# EAGLE schematic led_cube (EAGLE 6.2)
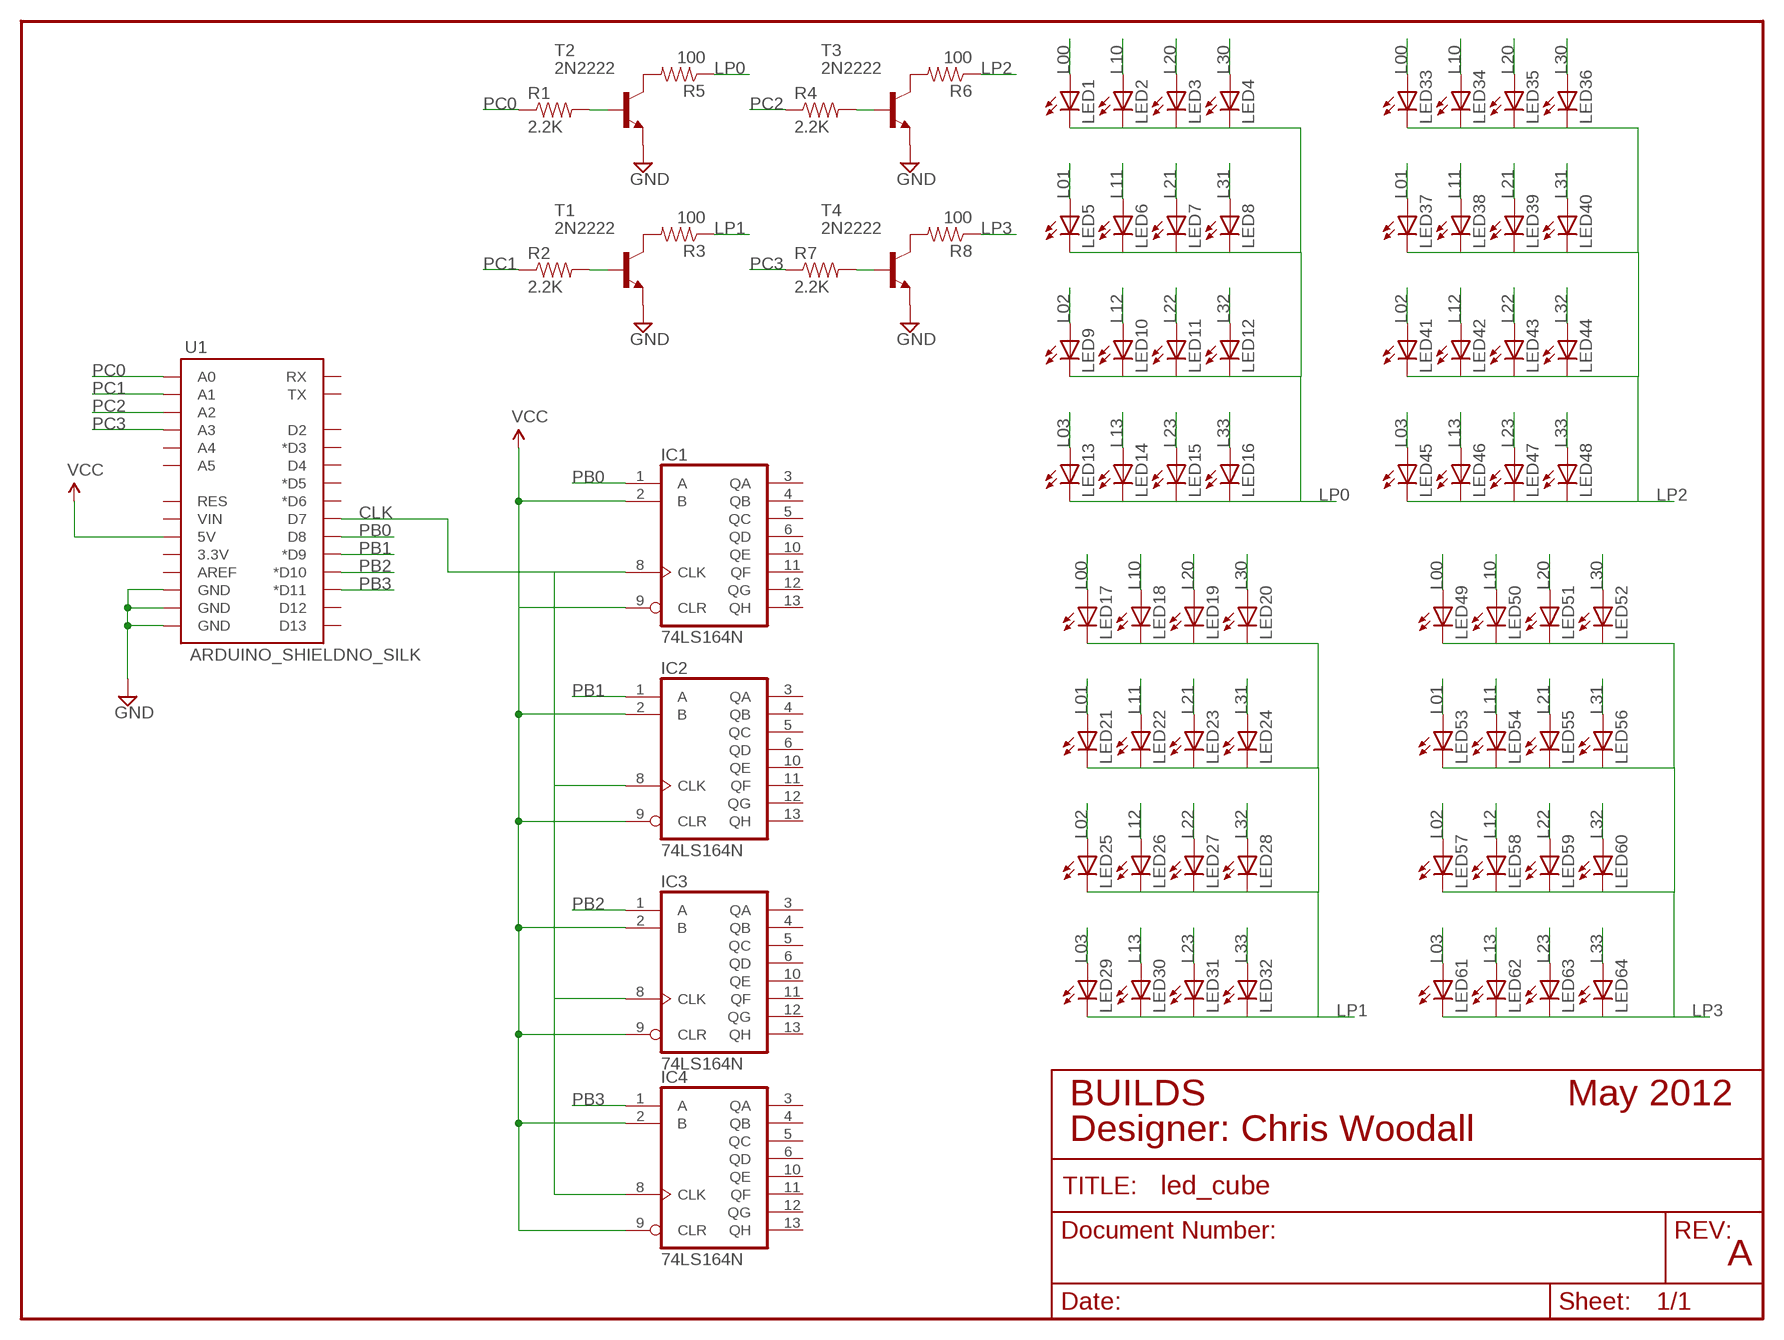
[diagram p0: schematic, sheet 1]

## Parts
IC1  74LS164N  [DIL14]
IC2  74LS164N  [DIL14]
IC3  74LS164N  [DIL14]
IC4  74LS164N  [DIL14]
LED1  LED  [SMARTLED-TTW]
LED2  LED  [SMARTLED-TTW]
LED3  LED  [SMARTLED-TTW]
LED4  LED  [SMARTLED-TTW]
LED5  LED  [SMARTLED-TTW]
LED6  LED  [SMARTLED-TTW]
LED7  LED  [SMARTLED-TTW]
LED8  LED  [SMARTLED-TTW]
LED9  LED  [SMARTLED-TTW]
LED10  LED  [SMARTLED-TTW]
LED11  LED  [SMARTLED-TTW]
LED12  LED  [SMARTLED-TTW]
LED13  LED  [SMARTLED-TTW]
LED14  LED  [SMARTLED-TTW]
LED15  LED  [SMARTLED-TTW]
LED16  LED  [SMARTLED-TTW]
LED17  LED  [SMARTLED-TTW]
LED18  LED  [SMARTLED-TTW]
LED19  LED  [SMARTLED-TTW]
LED20  LED  [SMARTLED-TTW]
LED21  LED  [SMARTLED-TTW]
LED22  LED  [SMARTLED-TTW]
LED23  LED  [SMARTLED-TTW]
LED24  LED  [SMARTLED-TTW]
LED25  LED  [SMARTLED-TTW]
LED26  LED  [SMARTLED-TTW]
LED27  LED  [SMARTLED-TTW]
LED28  LED  [SMARTLED-TTW]
LED29  LED  [SMARTLED-TTW]
LED30  LED  [SMARTLED-TTW]
LED31  LED  [SMARTLED-TTW]
LED32  LED  [SMARTLED-TTW]
LED33  LED  [SMARTLED-TTW]
LED34  LED  [SMARTLED-TTW]
LED35  LED  [SMARTLED-TTW]
LED36  LED  [SMARTLED-TTW]
LED37  LED  [SMARTLED-TTW]
LED38  LED  [SMARTLED-TTW]
LED39  LED  [SMARTLED-TTW]
LED40  LED  [SMARTLED-TTW]
LED41  LED  [SMARTLED-TTW]
LED42  LED  [SMARTLED-TTW]
LED43  LED  [SMARTLED-TTW]
LED44  LED  [SMARTLED-TTW]
LED45  LED  [SMARTLED-TTW]
LED46  LED  [SMARTLED-TTW]
LED47  LED  [SMARTLED-TTW]
LED48  LED  [SMARTLED-TTW]
LED49  LED  [SMARTLED-TTW]
LED50  LED  [SMARTLED-TTW]
LED51  LED  [SMARTLED-TTW]
LED52  LED  [SMARTLED-TTW]
LED53  LED  [SMARTLED-TTW]
LED54  LED  [SMARTLED-TTW]
LED55  LED  [SMARTLED-TTW]
LED56  LED  [SMARTLED-TTW]
LED57  LED  [SMARTLED-TTW]
LED58  LED  [SMARTLED-TTW]
LED59  LED  [SMARTLED-TTW]
LED60  LED  [SMARTLED-TTW]
LED61  LED  [SMARTLED-TTW]
LED62  LED  [SMARTLED-TTW]
LED63  LED  [SMARTLED-TTW]
LED64  LED  [SMARTLED-TTW]
R1  2.2K  RESISTOR0603-RES  [0603-RES]
R2  2.2K  RESISTOR0603-RES  [0603-RES]
R3  100  RESISTOR0603-RES  [0603-RES]
R4  2.2K  RESISTOR0603-RES  [0603-RES]
R5  100  RESISTOR0603-RES  [0603-RES]
R6  100  RESISTOR0603-RES  [0603-RES]
R7  2.2K  RESISTOR0603-RES  [0603-RES]
R8  100  RESISTOR0603-RES  [0603-RES]
T1  2N2222  [TO92-EBC-OVAL]
T2  2N2222  [TO92-EBC-OVAL]
T3  2N2222  [TO92-EBC-OVAL]
T4  2N2222  [TO92-EBC-OVAL]
U1  ARDUINO_SHIELDNO_SILK  [DUEMILANOVE_VIAS]

## Nets
CLK: IC1.8(CLK) IC2.8(CLK) IC3.8(CLK) IC4.8(CLK) U1.D7
GND: T1.E T2.E T3.E T4.E U1.GND@0(GND) U1.GND@1(GND) U1.GND@2(GND)
L00: LED1.A@1(A) LED17.A@1(A) LED33.A@1(A) LED49.A@1(A)
L01: LED5.A@1(A) LED21.A@1(A) LED37.A@1(A) LED53.A@1(A)
L02: LED9.A@1(A) LED25.A@1(A) LED41.A@1(A) LED57.A@1(A)
L03: LED13.A@1(A) LED29.A@1(A) LED45.A@1(A) LED61.A@1(A)
L10: LED2.A@1(A) LED18.A@1(A) LED34.A@1(A) LED50.A@1(A)
L11: LED6.A@1(A) LED22.A@1(A) LED38.A@1(A) LED54.A@1(A)
L12: LED10.A@1(A) LED26.A@1(A) LED42.A@1(A) LED58.A@1(A)
L13: LED14.A@1(A) LED30.A@1(A) LED46.A@1(A) LED62.A@1(A)
L20: LED3.A@1(A) LED19.A@1(A) LED35.A@1(A) LED51.A@1(A)
L21: LED7.A@1(A) LED23.A@1(A) LED39.A@1(A) LED55.A@1(A)
L22: LED11.A@1(A) LED27.A@1(A) LED43.A@1(A) LED59.A@1(A)
L23: LED15.A@1(A) LED31.A@1(A) LED47.A@1(A) LED63.A@1(A)
L30: LED4.A@1(A) LED20.A@1(A) LED36.A@1(A) LED52.A@1(A)
L31: LED8.A@1(A) LED24.A@1(A) LED40.A@1(A) LED56.A@1(A)
L32: LED12.A@1(A) LED28.A@1(A) LED44.A@1(A) LED60.A@1(A)
L33: LED16.A@1(A) LED32.A@1(A) LED48.A@1(A) LED64.A@1(A)
LP0: LED1.C@1(C) LED2.C@1(C) LED3.C@1(C) LED4.C@1(C) LED5.C@1(C) LED6.C@1(C) LED7.C@1(C) LED8.C@1(C) LED9.C@1(C) LED10.C@1(C) LED11.C@1(C) LED12.C@1(C) LED13.C@1(C) LED14.C@1(C) LED15.C@1(C) LED16.C@1(C) R5.1
LP1: LED17.C@1(C) LED18.C@1(C) LED19.C@1(C) LED20.C@1(C) LED21.C@1(C) LED22.C@1(C) LED23.C@1(C) LED24.C@1(C) LED25.C@1(C) LED26.C@1(C) LED27.C@1(C) LED28.C@1(C) LED29.C@1(C) LED30.C@1(C) LED31.C@1(C) LED32.C@1(C) R3.1
LP2: LED33.C@1(C) LED34.C@1(C) LED35.C@1(C) LED36.C@1(C) LED37.C@1(C) LED38.C@1(C) LED39.C@1(C) LED40.C@1(C) LED41.C@1(C) LED42.C@1(C) LED43.C@1(C) LED44.C@1(C) LED45.C@1(C) LED46.C@1(C) LED47.C@1(C) LED48.C@1(C) R6.1
LP3: LED49.C@1(C) LED50.C@1(C) LED51.C@1(C) LED52.C@1(C) LED53.C@1(C) LED54.C@1(C) LED55.C@1(C) LED56.C@1(C) LED57.C@1(C) LED58.C@1(C) LED59.C@1(C) LED60.C@1(C) LED61.C@1(C) LED62.C@1(C) LED63.C@1(C) LED64.C@1(C) R8.1
N$1: R2.2 T1.B
N$2: R1.2 T2.B
N$3: R5.2 T2.C
N$4: R3.2 T1.C
N$5: R4.2 T3.B
N$6: R6.2 T3.C
N$7: R7.2 T4.B
N$8: R8.2 T4.C
PB0: IC1.1(A) U1.D8
PB1: IC2.1(A) U1.D9(*D9)
PB2: IC3.1(A) U1.D10(*D10)
PB3: IC4.1(A) U1.D11(*D11)
PC0: R1.1 U1.A0
PC1: R2.1 U1.A1
PC2: R4.1 U1.A2
PC3: R7.1 U1.A3
VCC: IC1.2(B) IC1.9(CLR) IC2.2(B) IC2.9(CLR) IC3.2(B) IC3.9(CLR) IC4.2(B) IC4.9(CLR) U1.5V
Unconnected: IC1.3(QA) IC1.4(QB) IC1.5(QC) IC1.6(QD) IC1.10(QE) IC1.11(QF) IC1.12(QG) IC1.13(QH) IC2.3(QA) IC2.4(QB) IC2.5(QC) IC2.6(QD) IC2.10(QE) IC2.11(QF) IC2.12(QG) IC2.13(QH) IC3.3(QA) IC3.4(QB) IC3.5(QC) IC3.6(QD) IC3.10(QE) IC3.11(QF) IC3.12(QG) IC3.13(QH) IC4.3(QA) IC4.4(QB) IC4.5(QC) IC4.6(QD) IC4.10(QE) IC4.11(QF) IC4.12(QG) IC4.13(QH) U1.3.3V U1.A4 U1.A5 U1.AREF U1.D2 U1.D3(*D3) U1.D4 U1.D5(*D5) U1.D6(*D6) U1.D12 U1.D13 U1.RES U1.RX U1.TX U1.VIN

## Notes on the sheet
- BUILDS | May 2012
- Designer: Chris Woodall
- A

## Power pins joined to a net without a drawn wire
GND: IC1.7(GND) IC2.7(GND) IC3.7(GND) IC4.7(GND)
VCC: IC1.14(VCC) IC2.14(VCC) IC3.14(VCC) IC4.14(VCC)

## Library data of the parts
IC1-IC4 = 74xx-us:74*164: 8-bit parallel out SHIFT REGISTER
LED1-LED64 = led:LED: LED OSRAM: - CHIPLED LG R971, LG N971, LY N971, LG Q971, LY Q971, LO R971, LY R971 LH N974, LH R974 LS Q976, LO Q976, LY Q976 LO Q996 - Hyper CHIPLED LW Q18S LB Q993, LB Q99A, LB R99A - SideLED LS A670, LO A670, LY A670, LG A670, LP A670 LB A673, LV A673, LT A673, LW A673 LH A674 LY A675 LS A676, LA A676, LO A676, LY A676, LW A676 LS A679, LY A679, LG A679 - Hyper Micro SIDELED® LS Y876, LA Y876, LO Y876, LY Y876 LT Y87S - SmartLED LW L88C, LW L88S LB L89C, LB L89S, LG L890 LS L89K, LO L89K, LY L89K LS L896, LA L896, LO L896, LY L896 - TOPLED LS T670, LO T670, LY T670, LG T670, LP T670 LSG T670, LSP T670, LSY T670, LOP T670, LYG T670 LG T671, LOG T671, LSG T671 LB T673, LV T673, LT T673, LW T673 LH T674 LS T676, LA T676, LO T676, LY T676, LB T676, LH T676, LSB T676, LW T676 LB T67C, LV T67C, LT T67C, LS T67K, LO T67K, LY T67K, LW E67C LS E67B, LA E67B, LO E67B, LY E67B, LB E67C, LV E67C, LT E67C LW T67C LS T679, LY T679, LG T679 LS T770, LO T770, LY T770, LG T770, LP T770 LB T773, LV T773, LT T773, LW T773 LH T774 LS E675, LA E675, LY E675, LS T675 LS T776, LA T776, LO T776, LY T776, LB T776 LHGB T686 LT T68C, LB T68C - Hyper Mini TOPLED® LB M676 - Mini TOPLED Santana® LG M470 LS M47K, LO M47K, LY M47K Source: http://www.osram.convergy.de LUXEON: - LUMILED® LXK2-PW12-R00, LXK2-PW12-S00, LXK2-PW14-U00, LXK2-PW14-V00 LXK2-PM12-R00, LXK2-PM12-S00, LXK2-PM14-U00 LXK2-PE12-Q00, LXK2-PE12-R00, LXK2-PE12-S00, LXK2-PE14-T00, LXK2-PE14-U00 LXK2-PB12-K00, LXK2-PB12-L00, LXK2-PB12-M00, LXK2-PB14-N00, LXK2-PB14-P00, LXK2-PB14-Q00 LXK2-PR12-L00, LXK2-PR12-M00, LXK2-PR14-Q00, LXK2-PR14-R00 LXK2-PD12-Q00, LXK2-PD12-R00, LXK2-PD12-S00 LXK2-PH12-R00, LXK2-PH12-S00 LXK2-PL12-P00, LXK2-PL12-Q00, LXK2-PL12-R00 Source: www.luxeon.com KINGBRIGHT: KA-3528ASYC Source: www.kingbright.com
R1-R8 = SparkFun:RESISTOR: Resistor Basic schematic elements and footprints for 0603, 1206, and PTH resistors.
T1-T4 = adafruit:2N2222: NPN TRANSISTOR Big oval pads
U1 = SparkFun:ARDUINO_SHIELD